# Altium schematic sheet RS485.SchDoc
size A4
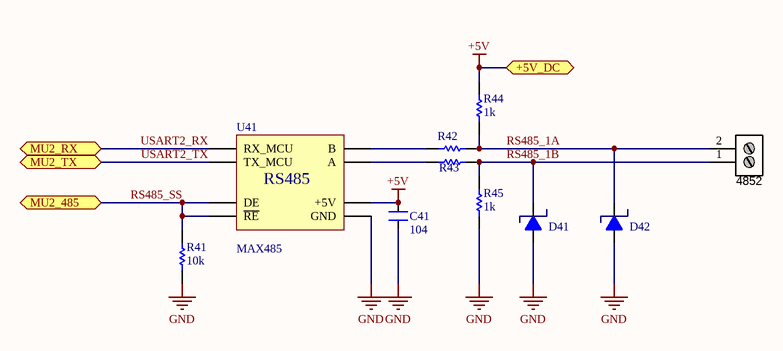
[diagram p0: RS485.SchDoc]

## Parts
4852  GreHed  [2P_PCB1]  (value not drawn)
C41  value 104  [CAPC2012N_F]  (hidden comment: Cap_104_0805)
D41  TVS Diodes  [DO-214AA]  (value not drawn)
D42  TVS Diodes  [DO-214AA]  (value not drawn)
R41  value 10k  [RESC1608N_F]  (hidden comment: Res_10k_0603)
R42  Res_10R_0805  [RESC2012N_F]  (value not drawn)
R43  Res_10R_0805  [RESC2012N_F]  (value not drawn)
R44  value 1k  [RESC1608N_F]  (hidden comment: Res_1k_0603)
R45  value 1k  [RESC1608N_F]  (hidden comment: Res_1k_0603)
U41  vl2: MAX485  [SOIC 8]  (hidden comment: MAX4858 chân cắm)

## Ports
+5V_DC, MU2_485, MU2_RX, MU2_TX

## Nets
+5V: C41.1 R44.2 U41.8(+5V) ; port +5V_DC
GND: C41.2 D41.A D42.A R41.1 R45.1 U41.5(GND)
RS485_1A: 4852.2 D42.K R42.2 R44.1
RS485_1B: 4852.1 D41.K R43.2 R45.2
RS485_SS: R41.2 U41.2(~{RE}) U41.3(DE) ; port MU2_485
USART2_RX: U41.1(RX_MCU) ; port MU2_RX
USART2_TX: U41.4(TX_MCU) ; port MU2_TX
NetR42_1: R42.1 U41.7(B)
NetR43_1: R43.1 U41.6(A)

## Library data of the parts
4852 = 2P_ScrewTerm_90S_3.81MM: Terminal Block Screw Type THT 2-Position 3.81mm pitch; Manufacturer 1: Tyco Electronics; Manufacturer Part Number 1: 1776113-2; Value: 2 position; Pitch: 0.150" (3.81mm); Positions Per Level: 2; Package / Case: Side Entry; 3.81mm pitch; Category: Connectors Interconnects; Color: Black; Supplier 1: Digi-Key; Supplier Part Number 1: A97976-ND
C41 = CAP NP
D41 D42 = TVS Diodes: TVS Diodes - Transient Voltage Suppressors; SMBJ12CA-E3/52: 12V,600W,DO-214AA; SMAJ5.0A: TVS Diodes - Transient Voltage Suppressors 5volts 400watts UniDirectional
R41 R44 R45 = Res
R42 R43 = Res: Value: 10R
U41 = 485: RS485; vl1: SN75176; cm2: 8 chân dán; cm1: 8 chân cắm